# Altium project custom_esp32.PrjPcb
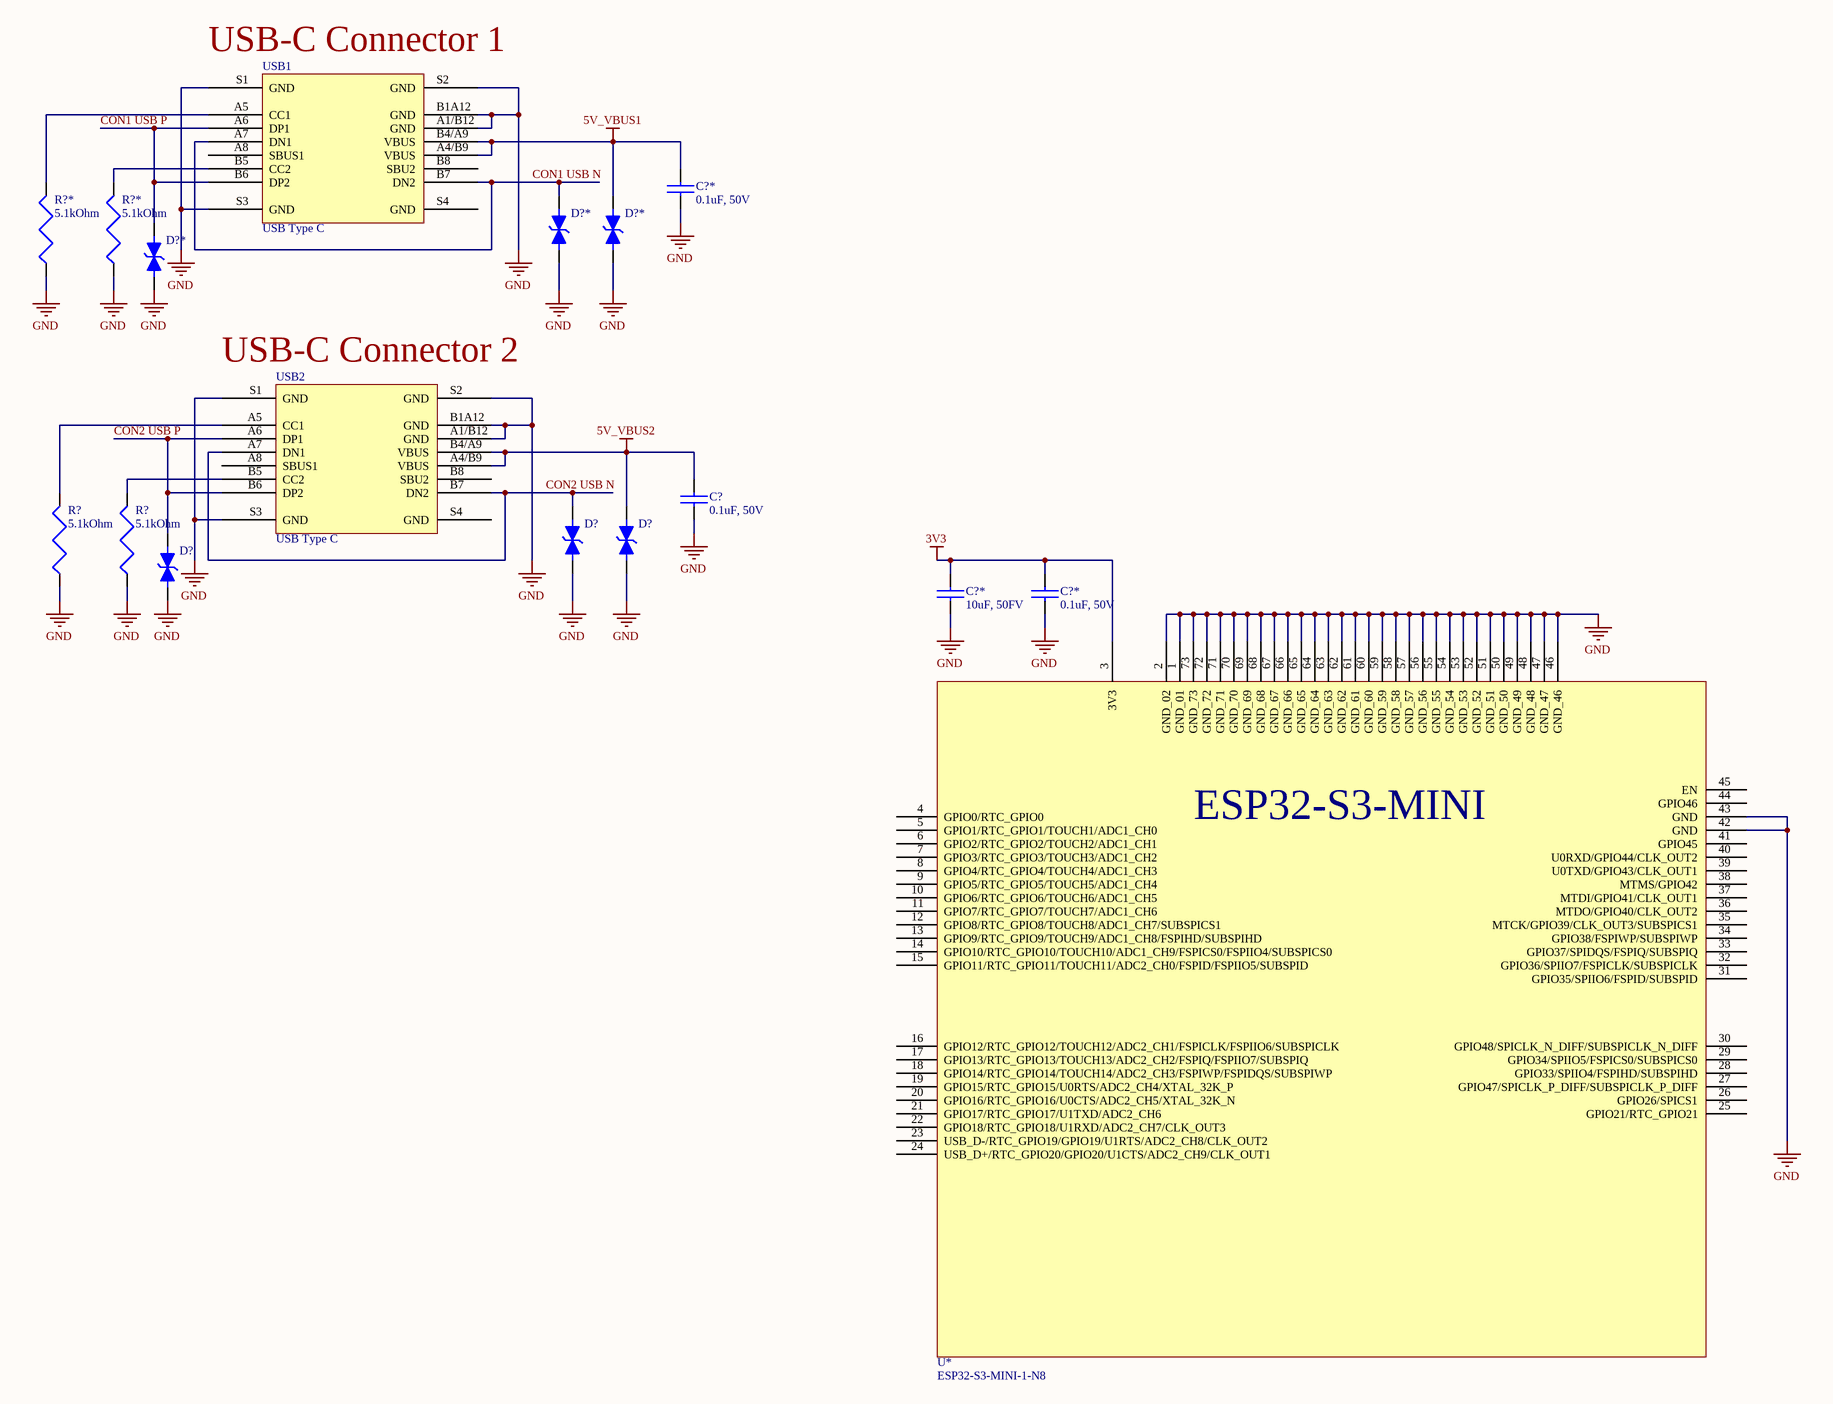
[diagram p0: custom_esp32.SchDoc]
1 sheet, 17 parts. Net scope: global (net labels, ports and power ports of the same name join across sheets).
Board file: custom_esp32.PcbDoc

## Sheet custom_esp32.SchDoc
size C; SheetNumber: 1; SheetTotal: 1

### Parts
(Parts that share a designator on the sheet are numbered #1, #2 ... from top to bottom, then left to right.)
C?  0.1uF, 50V
C?*#1  0.1uF, 50V
C?*#2  10uF, 50FV
C?*#3  0.1uF, 50V
D?#1  TVS DIODE 5.3VWM 12VC  (value not drawn)
D?#2  TVS DIODE 5.3VWM 12VC  (value not drawn)
D?#3  TVS DIODE 5.3VWM 12VC  (value not drawn)
D?*#1  TVS DIODE 5.3VWM 12VC  (value not drawn)
D?*#2  TVS DIODE 5.3VWM 12VC  (value not drawn)
D?*#3  TVS DIODE 5.3VWM 12VC  (value not drawn)
R?#1  5.1kOhm
R?#2  5.1kOhm
R?*#1  5.1kOhm
R?*#2  5.1kOhm
U*  ESP32-S3-MINI-1-N8
USB1  USB Type C
USB2  USB Type C

### Nets
3V3: C?*#2.1 C?*#3.1 U*.3(3V3)
5V_VBUS1: C?*#1.1 D?*#2.1 USB1.A4/B9(VBUS) USB1.B4/A9(VBUS)
5V_VBUS2: C?.1 D?#2.1 USB2.A4/B9(VBUS) USB2.B4/A9(VBUS)
GND: C?.2 C?*#1.2 C?*#2.2 C?*#3.2 D?#1.2 D?#2.2 D?#3.2 D?*#1.2 D?*#2.2 D?*#3.2 R?#1.1 R?#2.1 R?*#1.1 R?*#2.1 U*.1(GND_01) U*.2(GND_02) U*.42(GND) U*.43(GND) U*.46(GND_46) U*.47(GND_47) U*.48(GND_48) U*.49(GND_49) U*.50(GND_50) U*.51(GND_51) U*.52(GND_52) U*.53(GND_53) U*.54(GND_54) U*.55(GND_55) U*.56(GND_56) U*.57(GND_57) U*.58(GND_58) U*.59(GND_59) U*.60(GND_60) U*.61(GND_61) U*.62(GND_62) U*.63(GND_63) U*.64(GND_64) U*.65(GND_65) U*.66(GND_66) U*.67(GND_67) U*.68(GND_68) U*.69(GND_69) U*.70(GND_70) U*.71(GND_71) U*.72(GND_72) U*.73(GND_73) USB1.A1/B12(GND) USB1.B1A12(GND) USB1.S1(GND) USB1.S2(GND) USB1.S3(GND) USB2.A1/B12(GND) USB2.B1A12(GND) USB2.S1(GND) USB2.S2(GND) USB2.S3(GND)
CON1 USB N: D?*#1.1 USB1.A7(DN1) USB1.B7(DN2)
CON1 USB P: D?*#3.1 USB1.A6(DP1) USB1.B6(DP2)
CON2 USB N: D?#1.1 USB2.A7(DN1) USB2.B7(DN2)
CON2 USB P: D?#3.1 USB2.A6(DP1) USB2.B6(DP2)
NetR?#1_2: R?#1.2 USB2.A5(CC1)
NetR?#2_2: R?#2.2 USB2.B5(CC2)
NetR?*#1_2: R?*#1.2 USB1.A5(CC1)
NetR?*#2_2: R?*#2.2 USB1.B5(CC2)

Not connected (* = marked no-connect by the designer): U* 4(GPIO0/RTC_GPIO0) 5(GPIO1/RTC_GPIO1/TOUCH1/ADC1_CH0) 6(GPIO2/RTC_GPIO2/TOUCH2/ADC1_CH1) 7(GPIO3/RTC_GPIO3/TOUCH3/ADC1_CH2) 8(GPIO4/RTC_GPIO4/TOUCH4/ADC1_CH3) 9(GPIO5/RTC_GPIO5/TOUCH5/ADC1_CH4) 10(GPIO6/RTC_GPIO6/TOUCH6/ADC1_CH5) 11(GPIO7/RTC_GPIO7/TOUCH7/ADC1_CH6) 12(GPIO8/RTC_GPIO8/TOUCH8/ADC1_CH7/SUBSPICS1) 13(GPIO9/RTC_GPIO9/TOUCH9/ADC1_CH8/FSPIHD/SUBSPIHD) 14(GPIO10/RTC_GPIO10/TOUCH10/ADC1_CH9/FSPICS0/FSPIIO4/SUBSPICS0) 15(GPIO11/RTC_GPIO11/TOUCH11/ADC2_CH0/FSPID/FSPIIO5/SUBSPID) 16(GPIO12/RTC_GPIO12/TOUCH12/ADC2_CH1/FSPICLK/FSPIIO6/SUBSPICLK) 17(GPIO13/RTC_GPIO13/TOUCH13/ADC2_CH2/FSPIQ/FSPIIO7/SUBSPIQ) 18(GPIO14/RTC_GPIO14/TOUCH14/ADC2_CH3/FSPIWP/FSPIDQS/SUBSPIWP) 19(GPIO15/RTC_GPIO15/U0RTS/ADC2_CH4/XTAL_32K_P) 20(GPIO16/RTC_GPIO16/U0CTS/ADC2_CH5/XTAL_32K_N) 21(GPIO17/RTC_GPIO17/U1TXD/ADC2_CH6) 22(GPIO18/RTC_GPIO18/U1RXD/ADC2_CH7/CLK_OUT3) 23(USB_D-/RTC_GPIO19/GPIO19/U1RTS/ADC2_CH8/CLK_OUT2) 24(USB_D+/RTC_GPIO20/GPIO20/U1CTS/ADC2_CH9/CLK_OUT1) 25(GPIO21/RTC_GPIO21) 26(GPIO26/SPICS1) 27(GPIO47/SPICLK_P_DIFF/SUBSPICLK_P_DIFF) 28(GPIO33/SPIIO4/FSPIHD/SUBSPIHD) 29(GPIO34/SPIIO5/FSPICS0/SUBSPICS0) 30(GPIO48/SPICLK_N_DIFF/SUBSPICLK_N_DIFF) 31(GPIO35/SPIIO6/FSPID/SUBSPID) 32(GPIO36/SPIIO7/FSPICLK/SUBSPICLK) 33(GPIO37/SPIDQS/FSPIQ/SUBSPIQ) 34(GPIO38/FSPIWP/SUBSPIWP) 35(MTCK/GPIO39/CLK_OUT3/SUBSPICS1) 36(MTDO/GPIO40/CLK_OUT2) 37(MTDI/GPIO41/CLK_OUT1) 38(MTMS/GPIO42) 39(U0TXD/GPIO43/CLK_OUT1) 40(U0RXD/GPIO44/CLK_OUT2) 41(GPIO45) 44(GPIO46) 45(EN); USB1 A8(SBUS1) B8(SBU2) S4(GND); USB2 A8(SBUS1) B8(SBU2) S4(GND)

### Notes on the sheet
- (near USB1) USB-C Connector 1
- (near USB2) USB-C Connector 2
- (in symbol ESP32-S3-MINI-1-N8) ESP32-S3-MINI

### Library data of the parts
C? C?*#1 C?*#3 = GRM155R71H104ME14D: 0.1uF Ceramic Capacitor, Ceramic, 50V, 20% +Tol, 20% -Tol, X7R, 15% TC, Surface Mount, 0402; Manufacturer: Murata; Manufacturer Lifecycle Status: IN PRODUCTION; Value: 100nF; Supplier: DigiKey; Supplier Part Number: 490-10701-1-ND; Manufacturer Part Number: GRM155R71H104ME14D; RoHS: Compliant; Category: Ceramic Capacitors; Stock: 731279; Pricing: 1=0.1, 10=0.024, 50=0.0158, 100=0.0135, 500=0.00946, 1000=0.00824, 2500=0.00695, 5000=0.00618 (USD); Case/Package: 0402; Case Code (Imperial): 0402; Case Code (Metric): 1005; Composition: Ceramic; Depth: 500µm; Dielectric: X7R; Dielectric Material: Ceramic; Height: 500µm; Length: 1mm; Lifecycle Status: Production; Material: Ceramic; Max Operating Temperature: 125°C; Min Operating Temperature: -55°C; Mounting Technology: Surface Mount; Number of Terminals: 2; Packaging: Tape & Reel (TR); REACH SVHC: Yes; Schedule B: 8532240020, 8532240020|8532240020, 8532240020|8532240020|8532240020, 8532240020|8532240020|8532240020|8532240020; Termination: SMD/SMT; Thickness: 500µm; Tolerance: 20%; Voltage Rating: 50V; Voltage Rating (DC): 50V; Weight: 6.010099mg; Width: 500µm; ComponentLink1URL: https://datasheet.octopart.com:443/GRM155R71H104ME14D-Murata-datasheet-149523075.pdf?src-supplier=Newark; ComponentLink1Description: https://datasheet.octopart.com:443/GRM155R71H104ME14D-Murata-datasheet-149523075.pdf?src-supplier=Newark; ComponentLink2URL: https://datasheet.octopart.com:443/GRM155R71H104ME14D-Murata-datasheet-165579666.pdf?src-supplier=TME; ComponentLink2Description: https://datasheet.octopart.com:443/GRM155R71H104ME14D-Murata-datasheet-165579666.pdf?src-supplier=TME; ComponentLink3URL: https://datasheet.octopart.com:443/GRM155R71H104ME14D-Murata-datasheet-140691771.pdf?src-supplier=Ciiva; ComponentLink3Description: https://datasheet.octopart.com:443/GRM155R71H104ME14D-Murata-datasheet-140691771.pdf?src-supplier=Ciiva; ComponentLink4URL: https://datasheet.octopart.com:443/GRM155R71H104ME14D-Murata-datasheet-140689249.pdf?src-supplier=Ciiva; ComponentLink4Description: https://datasheet.octopart.com:443/GRM155R71H104ME14D-Murata-datasheet-140689249.pdf?src-supplier=Ciiva; ComponentLink5URL: https://datasheet.octopart.com:443/GRM155R71H104ME14D-Murata-datasheet-138740983.pdf?src-supplier=Ciiva; ComponentLink5Description: https://datasheet.octopart.com:443/GRM155R71H104ME14D-Murata-datasheet-138740983.pdf?src-supplier=Ciiva; ComponentLink6URL: https://datasheet.octopart.com:443/GRM155R71H104ME14D-Murata-datasheet-32479577.pdf?src-supplier=Future+Electronics; ComponentLink6Description: https://datasheet.octopart.com:443/GRM155R71H104ME14D-Murata-datasheet-32479577.pdf?src-supplier=Future+Electronics; ComponentLink7URL: https://datasheet.octopart.com/GRM155R71H104ME14D-Murata-datasheet-12515295.pdf; ComponentLink7Description: https://datasheet.octopart.com/GRM155R71H104ME14D-Murata-datasheet-12515295.pdf; ComponentLink8URL: https://datasheet.octopart.com/GRM155R71H104ME14D-Murata-datasheet-12510076.pdf; ComponentLink8Description: https://datasheet.octopart.com/GRM155R71H104ME14D-Murata-datasheet-12510076.pdf; ComponentLink9URL: https://datasheet.octopart.com/GRM155R71H104ME14D-Murata-datasheet-11978611.pdf; ComponentLink9Description: https://datasheet.octopart.com/GRM155R71H104ME14D-Murata-datasheet-11978611.pdf; ComponentLink10URL: https://datasheet.octopart.com/GRM155R71H104ME14D-Murata-datasheet-10025737.pdf; ComponentLink10Description: https://datasheet.octopart.com/GRM155R71H104ME14D-Murata-datasheet-10025737.pdf; ComponentLink11URL: https://datasheet.octopart.com/GRM155R71H104ME14D-Murata-datasheet-8819587.pdf; ComponentLink11Description: https://datasheet.octopart.com/GRM155R71H104ME14D-Murata-datasheet-8819587.pdf; ComponentLink12URL: https://datasheet.octopart.com/GRM155R71H104ME14D-Murata-datasheet-38882789.pdf; ComponentLink12Description: https://datasheet.octopart.com/GRM155R71H104ME14D-Murata-datasheet-38882789.pdf; ComponentLink13URL: https://datasheet.octopart.com:443/GRM155R71H104ME14D-Murata-datasheet-142045678.pdf?src-supplier=Arrow.cn; ComponentLink13Description: https://datasheet.octopart.com:443/GRM155R71H104ME14D-Murata-datasheet-142045678.pdf?src-supplier=Arrow.cn; ComponentLink14URL: http://sigma.octopart.com:80/reach_statement/Murata-company-16.pdf?src-supplier=Compliance+Statements; ComponentLink14Description: http://sigma.octopart.com:80/reach_statement/Murata-company-16.pdf?src-supplier=Compliance+Statements; LCSC Part Number: C182412
C?*#2 = CL32A106KBJNNNE: 50V 10uF X5R ±10% 1210 Multilayer Ceramic Capacitors MLCC - SMD/SMT ROHS; Manufacturer: Samsung Electro-Mechanics; Value: 10µF; Supplier: DigiKey; Supplier Part Number: 1276-3363-2-ND; Manufacturer Part Number: CL32A106KBJNNNE; RoHS: Compliant; Category: Ceramic Capacitors; Stock: 160000; Pricing: 1000=0.15866, 2000=0.14353, 3000=0.13915, 5000=0.1347, 7000=0.12955, 10000=0.12444, 12000=0.12371, 24000=0.12298, 25000=0.12242 (USD); Case/Package: 1210; Case Code (Imperial): 1210; Case Code (Metric): 3225; China RoHS: Compliant; Depth: 2.5mm; Dielectric: X5R; Dielectric Material: Ceramic; Height: 2.5mm; Lead Free: Lead Free; Length: 3.2mm; Lifecycle Status: Production; Material: Ceramic; Max Operating Temperature: 85°C; Min Operating Temperature: -55°C; Mounting Technology: Surface Mount; Number of Terminals: 2; Packaging: Tape & Reel (TR); REACH SVHC: Yes; Schedule B: 8532240020, 8532240020|8532240020|8532240020|8532240020|8532240020|8532240020|8532240020|8532240020|8532240020|8532240020|8532240020|8532240020|8532240020|8532240020|8532240020|8532240020|8532240020|8532240020|8532240020|8532240020|8532240020|8532240020|8532240020|85; Thickness: 2.6924mm; Tolerance: 10%; Voltage Rating: 50V; Voltage Rating (DC): 50V; Width: 2.5mm; ComponentLink1URL: https://datasheet.octopart.com:443/CL32A106KBJNNNE-Samsung-Electro-Mechanics-datasheet-141348239.pdf?src-supplier=Newark; ComponentLink1Description: https://datasheet.octopart.com:443/CL32A106KBJNNNE-Samsung-Electro-Mechanics-datasheet-141348239.pdf?src-supplier=Newark; ComponentLink2URL: https://datasheet.octopart.com:443/CL32A106KBJNNNE-Samsung-Electro-Mechanics-datasheet-136482658.pdf?src-supplier=Newark; ComponentLink2Description: https://datasheet.octopart.com:443/CL32A106KBJNNNE-Samsung-Electro-Mechanics-datasheet-136482658.pdf?src-supplier=Newark; ComponentLink3URL: https://datasheet.octopart.com:443/CL32A106KBJNNNE-Samsung-Electro-Mechanics-datasheet-149047602.pdf?src-supplier=Future+Electronics; ComponentLink3Description: https://datasheet.octopart.com:443/CL32A106KBJNNNE-Samsung-Electro-Mechanics-datasheet-149047602.pdf?src-supplier=Future+Electronics; ComponentLink4URL: https://datasheet.octopart.com:443/CL32A106KBJNNNE-Samsung-Electro-Mechanics-datasheet-67210002.pdf?src-supplier=Future+Electronics; ComponentLink4Description: https://datasheet.octopart.com:443/CL32A106KBJNNNE-Samsung-Electro-Mechanics-datasheet-67210002.pdf?src-supplier=Future+Electronics; ComponentLink5URL: https://datasheet.octopart.com:443/CL32A106KBJNNNE-Samsung-datasheet-58577986.pdf?src-supplier=Future+Electronics; ComponentLink5Description: https://datasheet.octopart.com:443/CL32A106KBJNNNE-Samsung-datasheet-58577986.pdf?src-supplier=Future+Electronics; ComponentLink6URL: https://datasheet.octopart.com:443/CL32A106KBJNNNE-Samsung-datasheet-37081328.pdf?src-supplier=Future+Electronics; ComponentLink6Description: https://datasheet.octopart.com:443/CL32A106KBJNNNE-Samsung-datasheet-37081328.pdf?src-supplier=Future+Electronics; ComponentLink7URL: https://datasheet.octopart.com/CL32A106KBJNNNE-Samsung-Electro-Mechanics-datasheet-97040617.pdf; ComponentLink7Description: https://datasheet.octopart.com/CL32A106KBJNNNE-Samsung-Electro-Mechanics-datasheet-97040617.pdf; ComponentLink8URL: https://datasheet.octopart.com/CL32A106KBJNNNE-Samsung-Electro-Mechanics-datasheet-8324245.pdf; ComponentLink8Description: https://datasheet.octopart.com/CL32A106KBJNNNE-Samsung-Electro-Mechanics-datasheet-8324245.pdf; ComponentLink9URL: https://datasheet.octopart.com/General-Multilayer-Ceramic-Capacitors-Samsung-datasheet-family-111.pdf; ComponentLink9Description: https://datasheet.octopart.com/General-Multilayer-Ceramic-Capacitors-Samsung-datasheet-family-111.pdf; ComponentLink10URL: https://datasheet.octopart.com:443/CL32A106KBJNNNE-Samsung-datasheet-8326407.pdf?src-supplier=TME; ComponentLink10Description: https://datasheet.octopart.com:443/CL32A106KBJNNNE-Samsung-datasheet-8326407.pdf?src-supplier=TME; ComponentLink11URL: http://sigma.octopart.com:80/rohs_certificate/General-Multilayer-Ceramic-Capacitors-Samsung-family-110.pdf?src-supplier=Compliance+Statements; ComponentLink11Description: http://sigma.octopart.com:80/rohs_certificate/General-Multilayer-Ceramic-Capacitors-Samsung-family-110.pdf?src-supplier=Compliance+Statements; ComponentLink12URL: http://sigma.octopart.com:80/rohs_statement/General-Multilayer-Ceramic-Capacitors-Samsung-family-132.pdf?src-supplier=Compliance+Statements; ComponentLink12Description: http://sigma.octopart.com:80/rohs_statement/General-Multilayer-Ceramic-Capacitors-Samsung-family-132.pdf?src-supplier=Compliance+Statements; ComponentLink13URL: http://sigma.octopart.com:80/reach_statement/General-Multilayer-Ceramic-Capacitors-Samsung-family-133.pdf?src-supplier=Compliance+Statements; ComponentLink13Description: http://sigma.octopart.com:80/reach_statement/General-Multilayer-Ceramic-Capacitors-Samsung-family-133.pdf?src-supplier=Compliance+Statements; LCSC Part Number: CL32A106KBJNNNE
D?#1-D?#3 D?*#1-D?*#3 = AQ3045-01ETG: Bi 30Kv 5V 0.35Pf Automotve Tvs Sod882/ Tr Rohs Compliant: Yes |Littelfuse AQ3045-01ETG; Breakdown Voltage: 7.8V; Clamping Voltage: 12V; Leakage Current: 100nA; Max Breakdown Voltage: 9V; Min Breakdown Voltage: 6.8V; Number of Channels: 1; Operating Supply Voltage: 5.3V; Peak Pulse Power: 40W; Polarity: Bidirectional; Supplier: DigiKey; Supplier Part Number: F9321CT-ND; Manufacturer: Littelfuse; Manufacturer Part Number: AQ3045-01ETG; RoHS: Compliant; Category: TVS Diodes; Stock: 13811; Pricing: 1=0.43, 10=0.262, 100=0.137, 500=0.131 (USD); Lifecycle Status: Production; Max Operating Temperature: 150°C; Min Operating Temperature: -40°C; Mounting Technology: Surface Mount; Number of Elements: 1; Number of Terminals: 2; Packaging: Cut Tape; Peak Reverse Current: 100nA; REACH SVHC: Yes; Reverse Standoff Voltage: 5.3V; ComponentLink1URL: https://datasheet.octopart.com:443/AQ3045-01ETG-Littelfuse-datasheet-180606588.pdf?src-supplier=IHS; ComponentLink1Description: https://datasheet.octopart.com:443/AQ3045-01ETG-Littelfuse-datasheet-180606588.pdf?src-supplier=IHS; ComponentLink2URL: https://datasheet.octopart.com:443/AQ3045-01ETG-Littelfuse-datasheet-183003566.pdf?src-supplier=JRH+Electronics; ComponentLink2Description: https://datasheet.octopart.com:443/AQ3045-01ETG-Littelfuse-datasheet-183003566.pdf?src-supplier=JRH+Electronics; ComponentLink3URL: https://datasheet.octopart.com:443/AQ3045-01ETG-Littelfuse-datasheet-140480283.pdf?src-supplier=ODG+(Origin+Data+Global); ComponentLink3Description: https://datasheet.octopart.com:443/AQ3045-01ETG-Littelfuse-datasheet-140480283.pdf?src-supplier=ODG+(Origin+Data+Global); ComponentLink4URL: https://datasheet.octopart.com:443/AQ3045-01ETG-Littelfuse-datasheet-101609968.pdf?src-supplier=Farnell; ComponentLink4Description: https://datasheet.octopart.com:443/AQ3045-01ETG-Littelfuse-datasheet-101609968.pdf?src-supplier=Farnell; ComponentLink5URL: https://datasheet.octopart.com:443/AQ3045-01ETG-Littelfuse-datasheet-170904929.pdf?src-supplier=Future+Electronics; ComponentLink5Description: https://datasheet.octopart.com:443/AQ3045-01ETG-Littelfuse-datasheet-170904929.pdf?src-supplier=Future+Electronics; LCSC Part Number: C3710326
R?#1 R?#2 R?*#1 R?*#2 = RT0402BRD075K1L: Fixed Resistor, Thin Film, 0.0625W, 5100ohm, 50V, 0.1% +/-Tol, 25ppm/Cel, Surface Mount, 0402; Manufacturer: Yageo Group; Max Power Dissipation: 63mW; Power Dissipation: 62.5mW; Value: 5.1kΩ; Temperature Coefficient: 25ppm/°C; Supplier: DigiKey; Supplier Part Number: YAG1457DKR-ND; Manufacturer Part Number: RT0402BRD075K1L; RoHS: Compliant; Category: Chip SMD Resistors; Stock: 7466; Pricing: 1=0.1, 10=0.069, 25=0.0672, 50=0.0652, 100=0.0612, 250=0.05712, 500=0.05406, 1000=0.04567 (USD); Case/Package: 0402; Case Code (Imperial): 0402; China RoHS: Non-Compliant; Composition: Thin Film; Depth: 500µm; Features: Moisture Resistant; Height: 300µm; Lead Free: Lead Free; Length: 990.6µm; Lifecycle Status: Production; Max Operating Temperature: 155°C; Military Standard: Not; Min Operating Temperature: -55°C; Mounting Technology: Surface Mount; Number of Terminals: 2; Number of Terminations: 2; Power Rating: 63mW; REACH SVHC: Yes; Termination: SMD/SMT; Tolerance: 0.1%; Voltage Rating: 50V; Voltage Rating (DC): 50V; Width: 500µm; Working Voltage: 50V; ComponentLink1URL: https://datasheet.octopart.com:443/RT0402BRD075K1L-Yageo-datasheet-176402239.pdf?src-supplier=Newark; ComponentLink1Description: https://datasheet.octopart.com:443/RT0402BRD075K1L-Yageo-datasheet-176402239.pdf?src-supplier=Newark; ComponentLink2URL: https://datasheet.octopart.com:443/RT0402BRD075K1L-Yageo-datasheet-96443642.pdf?src-supplier=Upverter; ComponentLink2Description: https://datasheet.octopart.com:443/RT0402BRD075K1L-Yageo-datasheet-96443642.pdf?src-supplier=Upverter; ComponentLink3URL: https://datasheet.octopart.com:443/RT0402BRD075K1L-Yageo-datasheet-169971040.pdf?src-supplier=Future+Electronics; ComponentLink3Description: https://datasheet.octopart.com:443/RT0402BRD075K1L-Yageo-datasheet-169971040.pdf?src-supplier=Future+Electronics; ComponentLink4URL: https://datasheet.octopart.com:443/RT0402BRD075K1L-Yageo-datasheet-166250672.pdf?src-supplier=Future+Electronics; ComponentLink4Description: https://datasheet.octopart.com:443/RT0402BRD075K1L-Yageo-datasheet-166250672.pdf?src-supplier=Future+Electronics; ComponentLink5URL: https://datasheet.octopart.com:443/RT0402BRD075K1L-Yageo-datasheet-136673517.pdf?src-supplier=Future+Electronics; ComponentLink5Description: https://datasheet.octopart.com:443/RT0402BRD075K1L-Yageo-datasheet-136673517.pdf?src-supplier=Future+Electronics; ComponentLink6URL: https://datasheet.octopart.com:443/RT0402BRD075K1L-Yageo-datasheet-137700930.pdf?src-supplier=Future+Electronics; ComponentLink6Description: https://datasheet.octopart.com:443/RT0402BRD075K1L-Yageo-datasheet-137700930.pdf?src-supplier=Future+Electronics; ComponentLink7URL: https://datasheet.octopart.com:443/RT0402BRD075K1L-Yageo-datasheet-68361100.pdf?src-supplier=Future+Electronics; ComponentLink7Description: https://datasheet.octopart.com:443/RT0402BRD075K1L-Yageo-datasheet-68361100.pdf?src-supplier=Future+Electronics; ComponentLink8URL: https://datasheet.octopart.com:443/RT0402BRD075K1L-Yageo-datasheet-41589729.pdf?src-supplier=Future+Electronics; ComponentLink8Description: https://datasheet.octopart.com:443/RT0402BRD075K1L-Yageo-datasheet-41589729.pdf?src-supplier=Future+Electronics; ComponentLink9URL: https://datasheet.octopart.com:443/RT0402BRD075K1L-Yageo-datasheet-12594463.pdf?src-supplier=Future+Electronics; ComponentLink9Description: https://datasheet.octopart.com:443/RT0402BRD075K1L-Yageo-datasheet-12594463.pdf?src-supplier=Future+Electronics; ComponentLink10URL: https://datasheet.octopart.com:443/RT0402BRD075K1L-Yageo-datasheet-34924148.pdf?src-supplier=Future+Electronics; ComponentLink10Description: https://datasheet.octopart.com:443/RT0402BRD075K1L-Yageo-datasheet-34924148.pdf?src-supplier=Future+Electronics; ComponentLink11URL: https://datasheet.octopart.com:443/RT0402BRD075K1L-Yageo-Group-datasheet-141265893.pdf?src-supplier=ODG+(Origin+Data+Global); ComponentLink11Description: https://datasheet.octopart.com:443/RT0402BRD075K1L-Yageo-Group-datasheet-141265893.pdf?src-supplier=ODG+(Origin+Data+Global); ComponentLink12URL: https://datasheet.octopart.com/RT0402BRD075K1L-Yageo-datasheet-86813807.pdf; ComponentLink12Description: https://datasheet.octopart.com/RT0402BRD075K1L-Yageo-datasheet-86813807.pdf; ComponentLink13URL: http://sigma.octopart.com:80/rohs_statement/Yageo-company-2.pdf?src-supplier=Compliance+Statements; ComponentLink13Description: http://sigma.octopart.com:80/rohs_statement/Yageo-company-2.pdf?src-supplier=Compliance+Statements; ComponentLink14URL: http://sigma.octopart.com:80/conflict_mineral_statement/Yageo-company-3.pdf?src-supplier=Compliance+Statements; ComponentLink14Description: http://sigma.octopart.com:80/conflict_mineral_statement/Yageo-company-3.pdf?src-supplier=Compliance+Statements; LCSC Part Number: C852856
U* = ESP32-S3-MINI-1-N8: SMD module, ESP32-S3FN8, 8 MB SPI flash, PCB antenna; Manufacturer: Espressif Systems; Supplier: DigiKey; Supplier Part Number: 5407-ESP32-S3-MINI-1-N8DKR-ND; Manufacturer Part Number: ESP32-S3-MINI-1-N8; RoHS: Compliant; Category: RF Transceiver Modules and Modems; Stock: 7176; Pricing: 1=5.28, 10=4.566, 25=4.3196, 100=3.9802, 250=3.7768 (USD); ComponentLink1URL: https://datasheet.octopart.com:443/ESP32-S3-MINI-1-N8-Espressif-Systems-datasheet-188867343.pdf?src-supplier=TME; ComponentLink1Description: https://datasheet.octopart.com:443/ESP32-S3-MINI-1-N8-Espressif-Systems-datasheet-188867343.pdf?src-supplier=TME; ComponentLink2URL: https://datasheet.octopart.com:443/ESP32-S3-MINI-1-N8-Espressif-Systems-datasheet-165560562.pdf?src-supplier=TME; ComponentLink2Description: https://datasheet.octopart.com:443/ESP32-S3-MINI-1-N8-Espressif-Systems-datasheet-165560562.pdf?src-supplier=TME; ComponentLink3URL: https://datasheet.octopart.com:443/ESP32-S3-MINI-1-N8-Espressif-Systems-datasheet-165560559.pdf?src-supplier=TME; ComponentLink3Description: https://datasheet.octopart.com:443/ESP32-S3-MINI-1-N8-Espressif-Systems-datasheet-165560559.pdf?src-supplier=TME; LCSC: C2913206
USB1 USB2 = 217179-0001: USB Connector, USB Type C, USB 2.0, Receptacle, 16 Ways, Surface Mount, Through Hole Mount; Manufacturer: Molex; Contact Resistance: 50mΩ; Current Rating: 1.25A; Dielectric Material: Polyamide; Insulation Resistance: 100MΩ; Number of Contacts: 16; Number of Ports: 1; USB Standard: USB 2.0; Voltage Rating: 30V; Supplier: DigiKey; Supplier Part Number: 900-2171790001CT-ND; Manufacturer Part Number: 217179-0001; RoHS: Compliant; Category: USB Connectors; Stock: 6061; Pricing: 1=0.83, 10=0.704, 25=0.6596, 50=0.628, 100=0.598, 250=0.56052, 500=0.53374, 1200=0.50175, 2400=0.4778, 3600=0.46433, 6000=0.4479, 8400=0.4374, 12000=0.42654 (USD); Contact Gender: Female; Contact Material: Gold, Nickel; Gender: Receptacle; Height: 3.36mm; Lifecycle Status: Production; Max Operating Temperature: 85°C; Min Operating Temperature: -40°C; Pins: 16; Number of Rows: 1; REACH SVHC: Yes; Shell Finish: Nickel; Shell Material: Stainless Steel; Terminal Pitch: 500µm; ComponentLink1URL: https://datasheet.octopart.com:443/217179-0001-Molex-datasheet-158871109.pdf?src-supplier=ODG+(Origin+Data+Global); ComponentLink1Description: https://datasheet.octopart.com:443/217179-0001-Molex-datasheet-158871109.pdf?src-supplier=ODG+(Origin+Data+Global); ComponentLink2URL: https://sigma.octopart.com:443/158871110/technical_drawing/Molex-217179-0001.pdf?src-supplier=Upverter; ComponentLink2Description: https://sigma.octopart.com:443/158871110/technical_drawing/Molex-217179-0001.pdf?src-supplier=Upverter; ComponentLink3URL: https://datasheet.octopart.com:443/217179-0001-Molex-datasheet-164573281.pdf?src-supplier=RS+(Formerly+Allied+Electronics); ComponentLink3Description: https://datasheet.octopart.com:443/217179-0001-Molex-datasheet-164573281.pdf?src-supplier=RS+(Formerly+Allied+Electronics); ComponentLink4URL: http://sigma.octopart.com:80/conflict_mineral_statement/Molex-company-72.pdf?src-supplier=Compliance+Statements; ComponentLink4Description: http://sigma.octopart.com:80/conflict_mineral_statement/Molex-company-72.pdf?src-supplier=Compliance+Statements; ComponentLink5URL: http://sigma.octopart.com:80/rohs_statement/Molex-company-73.pdf?src-supplier=Compliance+Statements; ComponentLink5Description: http://sigma.octopart.com:80/rohs_statement/Molex-company-73.pdf?src-supplier=Compliance+Statements; ComponentLink6URL: http://sigma.octopart.com:80/reach_statement/Molex-company-74.pdf?src-supplier=Compliance+Statements; ComponentLink6Description: http://sigma.octopart.com:80/reach_statement/Molex-company-74.pdf?src-supplier=Compliance+Statements